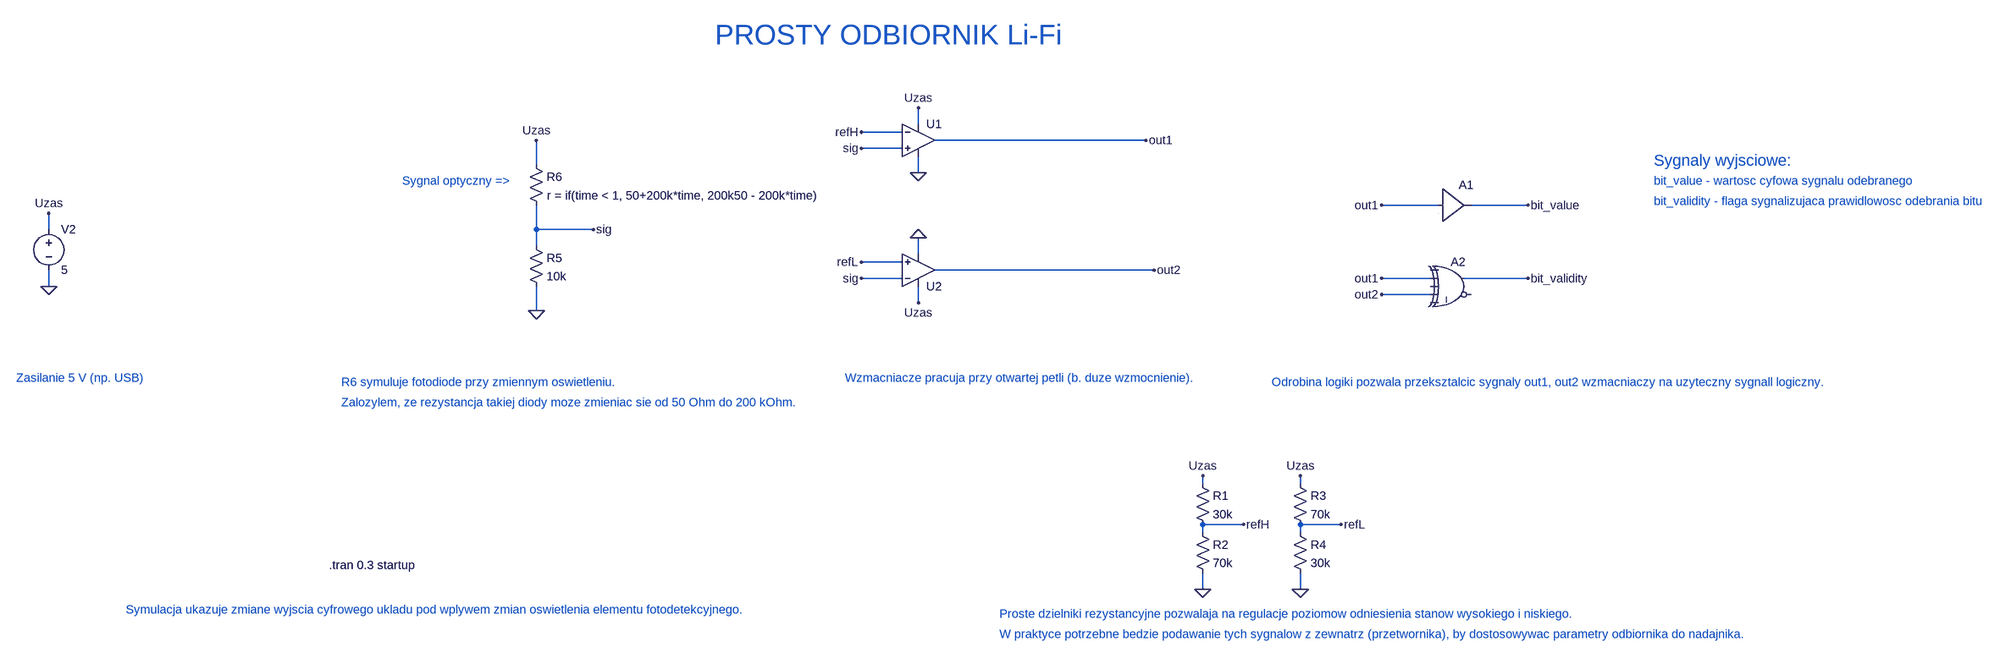
[diagram p0: schematic LiFi_prosty_uklad_odbiornika.asc]
LiFi_prosty_uklad_odbiornika.asc, the LTspice schematic file:
Version 4
SHEET 1 2984 680
WIRE 736 -1200 736 -1232
WIRE 704 -1184 624 -1184
WIRE 1184 -1168 768 -1168
WIRE 704 -1152 624 -1152
WIRE -16 -1120 -16 -1168
WIRE 736 -1104 736 -1136
WIRE 1760 -1040 1648 -1040
WIRE 1936 -1040 1824 -1040
WIRE -976 -992 -976 -1024
WIRE -16 -992 -16 -1040
WIRE 96 -992 -16 -992
WIRE -16 -960 -16 -992
WIRE 736 -944 736 -976
WIRE 704 -928 624 -928
WIRE 1200 -912 768 -912
WIRE 704 -896 624 -896
WIRE 1744 -896 1648 -896
WIRE 1936 -896 1808 -896
WIRE -976 -880 -976 -912
WIRE 1744 -864 1648 -864
WIRE 736 -848 736 -880
WIRE -16 -832 -16 -880
WIRE 1296 -256 1296 -272
WIRE 1488 -256 1488 -272
WIRE 1376 -176 1296 -176
WIRE 1568 -176 1488 -176
WIRE 1296 -160 1296 -176
WIRE 1488 -160 1488 -176
WIRE 1296 -48 1296 -80
WIRE 1488 -48 1488 -80
FLAG 736 -1104 0
FLAG -976 -880 0
FLAG -976 -1024 Uzas
FLAG 1296 -272 Uzas
FLAG 1296 -48 0
FLAG 1376 -176 refH
FLAG 624 -1184 refH
FLAG 736 -1232 Uzas
FLAG 736 -976 0
FLAG 624 -928 refL
FLAG 736 -848 Uzas
FLAG 624 -1152 sig
FLAG 624 -896 sig
FLAG 1488 -272 Uzas
FLAG 1488 -48 0
FLAG 1568 -176 refL
FLAG 1936 -1040 bit_value
FLAG 1936 -896 bit_validity
FLAG 96 -992 sig
FLAG -16 -1168 Uzas
FLAG -16 -832 0
FLAG 1184 -1168 out1
FLAG 1648 -896 out1
FLAG 1648 -1040 out1
FLAG 1200 -912 out2
FLAG 1648 -864 out2
SYMBOL voltage -976 -1008 R0
WINDOW 123 0 0 Left 2
WINDOW 39 0 0 Left 2
SYMATTR InstName V2
SYMATTR Value 5
SYMBOL Opamps\\UniversalOpamp2 736 -1168 R0
SYMATTR InstName U1
SYMBOL res 1280 -272 R0
SYMATTR InstName R1
SYMATTR Value 30k
SYMBOL res 1280 -176 R0
SYMATTR InstName R2
SYMATTR Value 70k
SYMBOL Opamps\\UniversalOpamp2 736 -912 M180
SYMATTR InstName U2
SYMBOL res 1472 -272 R0
SYMATTR InstName R3
SYMATTR Value 70k
SYMBOL res 1472 -176 R0
SYMATTR InstName R4
SYMATTR Value 30k
SYMBOL Digital\\xor 1792 -944 R0
SYMATTR InstName A2
SYMBOL res -32 -976 R0
SYMATTR InstName R5
SYMATTR Value 10k
SYMBOL res -32 -1136 R0
WINDOW 3 37 77 Left 2
SYMATTR Value r = if(time < 1, 50+200k*time, 200k50 - 200k*time)
SYMATTR InstName R6
SYMBOL Digital\\buf1 1760 -1104 R0
SYMATTR InstName A1
TEXT -424 -96 Left 2 !.tran 0.3 startup
TEXT -400 -680 Left 2 ;R6 symuluje fotodiode przy zmiennym oswietleniu.
TEXT -400 -640 Left 2 ;Zalozylem, ze rezystancja takiej diody moze zmieniac sie od 50 Ohm do 200 kOhm.
TEXT 592 -688 Left 2 ;Wzmacniacze pracuja przy otwartej petli (b. duze wzmocnienie).
TEXT 1432 -680 Left 2 ;Odrobina logiki pozwala przeksztalcic sygnaly out1, out2 wzmacniaczy na uzyteczny sygnall logiczny.
TEXT -1040 -688 Left 2 ;Zasilanie 5 V (np. USB)
TEXT 896 0 Left 2 ;Proste dzielniki rezystancyjne pozwalaja na regulacje poziomow odniesienia stanow wysokiego i niskiego.
TEXT 896 40 Left 2 ;W praktyce potrzebne bedzie podawanie tych sygnalow z zewnatrz (przetwornika), by dostosowywac parametry odbiornika do nadajnika.
TEXT 336 -1376 Left 5 ;PROSTY ODBIORNIK Li-Fi
TEXT -824 -8 Left 2 ;Symulacja ukazuje zmiane wyjscia cyfrowego ukladu pod wplywem zmian oswietlenia elementu fotodetekcyjnego.
TEXT 2184 -1128 Left 3 ;Sygnaly wyjsciowe:
TEXT 2184 -1088 Left 2 ;bit_value - wartosc cyfowa sygnalu odebranego
TEXT 2184 -1048 Left 2 ;bit_validity - flaga sygnalizujaca prawidlowosc odebrania bitu
TEXT -280 -1088 Left 2 ;Sygnal optyczny =>

The netlist it stands for:
* LiFi_prosty_uklad_odbiornika.asc
V2 Uzas 0 5
XU1 sig refH Uzas 0 out1 level.2 Avol=1Meg GBW=10Meg Slew=10Meg ilimit=25m rail=0 Vos=0 phimargin=45 en=0 enk=0 in=0 ink=0 Rin=500Meg  ; pins IN+ IN- V+ V- OUT
R1 Uzas refH 30k
R2 refH 0 70k
XU2 refL sig Uzas 0 out2 level.2 Avol=1Meg GBW=10Meg Slew=10Meg ilimit=25m rail=0 Vos=0 phimargin=45 en=0 enk=0 in=0 ink=0 Rin=500Meg  ; pins IN+ IN- V+ V- OUT
R3 Uzas refL 70k
R4 refL 0 30k
A2 0 out1 0 out2 0 0 bit_validity 0 XOR
R5 sig 0 10k
R6 Uzas sig r = if(time < 1, 50+200k*time, 200k50 - 200k*time)
A1 out1 0 0 0 0 0 bit_value 0 BUF
.tran 0.3 startup
* R6 symuluje fotodiode przy zmiennym oswietleniu.
* Zalozylem, ze rezystancja takiej diody moze zmieniac sie od 50 Ohm do 200 kOhm.
* Wzmacniacze pracuja przy otwartej petli (b. duze wzmocnienie).
* Odrobina logiki pozwala przeksztalcic sygnaly out1, out2 wzmacniaczy na uzyteczny sygnall logiczny.
* Zasilanie 5 V (np. USB)
* Proste dzielniki rezystancyjne pozwalaja na regulacje poziomow odniesienia stanow wysokiego i niskiego.
* W praktyce potrzebne bedzie podawanie tych sygnalow z zewnatrz (przetwornika), by dostosowywac parametry odbiornika do nadajnika.
* PROSTY ODBIORNIK Li-Fi
* Symulacja ukazuje zmiane wyjscia cyfrowego ukladu pod wplywem zmian oswietlenia elementu fotodetekcyjnego.
* Sygnaly wyjsciowe:
* bit_value - wartosc cyfowa sygnalu odebranego
* bit_validity - flaga sygnalizujaca prawidlowosc odebrania bitu
* Sygnal optyczny =>
.lib UniversalOpamps2.sub
.backanno
.end